# Altium schematic sheet Connectors.SchDoc
size A4
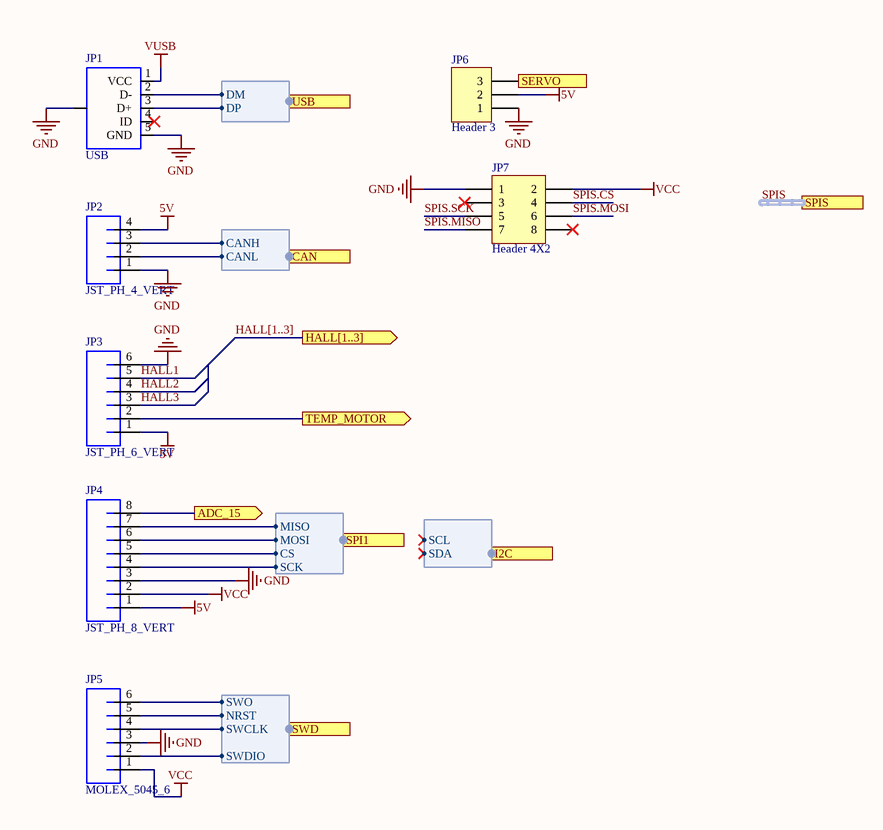
[diagram p0: Connectors.SchDoc]

## Parts
JP1  USB  [USB-MICROB_HORZ]
JP2  JST_PH_4_VERT  [JST-PH-4-PTH-VERT]
JP3  JST_PH_6_VERT  [JST-PH-6-PTH-VERT]
JP4  JST_PH_8_VERT  [JST-PH-8-PTH-VERT]
JP5  MOLEX_5045_6  [MOLEX_5045_6]
JP6  Header 3  [HDR1X3]
JP7  Header 4X2  [HDR2X4]

## Ports
ADC_15 (out), CAN (harness CAN Output), HALL[1..3] (out), I2C (harness I2C), SERVO (in), SPI1 (harness SPI), SPIS (harness SPI), SWD (harness SWD), TEMP_MOTOR (out), USB (harness USB)

## Harnesses
USB: DM, DP
CAN Output: CANL, CANH
SWD: SWCLK, SWDIO, SWO, NRST
SPI: CS, SCK, MISO, MOSI
I2C: SDA, SCL

## Nets
5V: JP2.4 JP3.1 JP4.1 JP6.2
GND: JP1.5(GND) JP1.6(SHIELD) JP2.1 JP3.6 JP4.3 JP5.3 JP6.1 JP7.1
VCC: JP4.2 JP5.1 JP7.2
VUSB: JP1.1(VCC)
ADC_15: JP4.8 ; port ADC_15
HALL1: JP3.5
HALL2: JP3.4
HALL3: JP3.3
SERVO: JP6.3 ; port SERVO
SPIS.CS: JP7.4
SPIS.MISO: JP7.7
SPIS.MOSI: JP7.6
SPIS.SCK: JP7.5
TEMP_MOTOR: JP3.2 ; port TEMP_MOTOR
NetJP1_2: JP1.2(D-) ; port USB.DM
NetJP1_3: JP1.3(D+) ; port USB.DP
NetJP2_2: JP2.2 ; port CAN.CANL
NetJP2_3: JP2.3 ; port CAN.CANH
NetJP4_4: JP4.4 ; port SPI1.SCK
NetJP4_5: JP4.5 ; port SPI1.CS
NetJP4_6: JP4.6 ; port SPI1.MOSI
NetJP4_7: JP4.7 ; port SPI1.MISO
NetJP5_2: JP5.2 ; port SWD.SWDIO
NetJP5_4: JP5.4 ; port SWD.SWCLK
NetJP5_5: JP5.5 ; port SWD.NRST
NetJP5_6: JP5.6 ; port SWD.SWO

Not connected (* = marked no-connect by the designer): JP1 4(ID)*; JP7 3* 8*

## Buses and harness runs
bus HALL[1..3] = port HALL[1..3]
harness SPIS = port SPIS

## Library data of the parts
JP1 = USB_MICROB_SMT: pin to pad: 1>VBUS 2>D- 3>D+ 4>ID 5>GND 6>MT1+P$1+P$2+MT2; PartNumber: 10118192-0001LF; Manufacturer: Amphenol FCI; Mounting Technology: Surface Mount; PackageReference: USB - Micro B
JP2 = JST_PH_4_VERT: PartNumber: B4B-PH-K-S(LF)(SN); Manufacturer: JST Sales America Inc.; PackageReference: JST-PH; Mounting Technology: Through Hole
JP3 = JST_PH_6_VERT: PartNumber: B6B-PH-K-S(LF)(SN); Manufacturer: JST Sales America Inc.; PackageReference: JST-PH; Mounting Technology: Through Hole
JP4 = JST_PH_8_VERT: Manufacturer: JST Sales America Inc.; PartNumber: B8B-PH-K-S(LF)(SN); Mounting Technology: Through Hole; PackageReference: JST-PH
JP5 = MOLEX_5045_6: PartNumber: B6B-PH-K-S(LF)(SN); Manufacturer: JST Sales America Inc.; PackageReference: JST-PH; Mounting Technology: Through Hole
JP6 = Header 3: Header, 3-Pin; LatestRevisionDate: 17-Jul-2002; LatestRevisionNote: Re-released for DXP Platform.; Publisher: Altium Limited
JP7 = Header 4X2: Header, 4-Pin, Dual row; LatestRevisionDate: 17-Jul-2002; LatestRevisionNote: Re-released for DXP Platform.; Publisher: Altium Limited